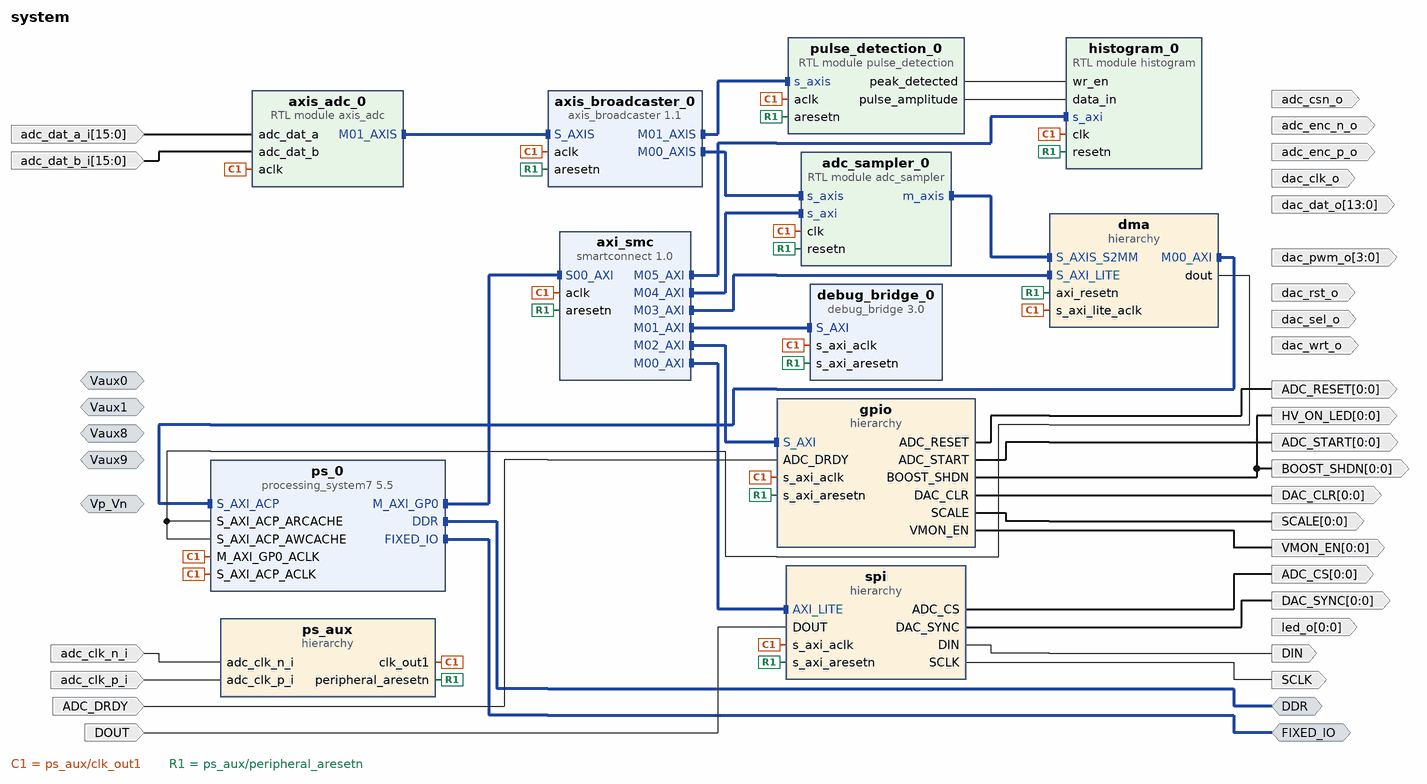
[diagram p0: block diagram of the top level]
# Vivado block design system, xc7z010clg400-1, Vivado 2025.1
create_bd_design system

create_bd_intf_port -mode Slave -vlnv xilinx.com:interface:diff_analog_io_rtl:1.0 Vp_Vn
create_bd_intf_port -mode Slave -vlnv xilinx.com:interface:diff_analog_io_rtl:1.0 Vaux0
create_bd_intf_port -mode Slave -vlnv xilinx.com:interface:diff_analog_io_rtl:1.0 Vaux1
create_bd_intf_port -mode Slave -vlnv xilinx.com:interface:diff_analog_io_rtl:1.0 Vaux9
create_bd_intf_port -mode Slave -vlnv xilinx.com:interface:diff_analog_io_rtl:1.0 Vaux8
create_bd_intf_port -mode Master -vlnv xilinx.com:interface:ddrx_rtl:1.0 DDR
create_bd_intf_port -mode Master -vlnv xilinx.com:display_processing_system7:fixedio_rtl:1.0 FIXED_IO
create_bd_port -dir I -from 15 -to 0 adc_dat_a_i
create_bd_port -dir I -from 15 -to 0 adc_dat_b_i
create_bd_port -dir I adc_clk_p_i
create_bd_port -dir I adc_clk_n_i
create_bd_port -dir O adc_enc_p_o
create_bd_port -dir O adc_enc_n_o
create_bd_port -dir O adc_csn_o
create_bd_port -dir O -from 13 -to 0 dac_dat_o
create_bd_port -dir O dac_clk_o
create_bd_port -dir O dac_rst_o
create_bd_port -dir O dac_sel_o
create_bd_port -dir O dac_wrt_o
create_bd_port -dir O -from 3 -to 0 dac_pwm_o
create_bd_port -dir O -from 0 -to 0 led_o
create_bd_port -dir O -type data DIN
create_bd_port -dir O -type clk SCLK
create_bd_port -dir I -type data DOUT
create_bd_port -dir O -from 0 -to 0 -type rst DAC_CLR
create_bd_port -dir O -from 0 -to 0 -type data BOOST_SHDN
create_bd_port -dir O -from 0 -to 0 -type ce DAC_SYNC
create_bd_port -dir O -from 0 -to 0 -type data SCALE
create_bd_port -dir O -from 0 -to 0 HV_ON_LED
create_bd_port -dir O -from 0 -to 0 ADC_CS
create_bd_port -dir I -type data ADC_DRDY
create_bd_port -dir O -from 0 -to 0 -type rst ADC_RESET
create_bd_port -dir O -from 0 -to 0 -type data ADC_START
create_bd_port -dir O -from 0 -to 0 -type data VMON_EN

create_bd_cell -type ip -vlnv xilinx.com:ip:processing_system7:5.5 ps_0
set_property -dict [list \
  CONFIG.PCW_APU_PERIPHERAL_FREQMHZ 666.666666 \
  CONFIG.PCW_ENET0_PERIPHERAL_ENABLE 0 \
  CONFIG.PCW_FPGA0_PERIPHERAL_FREQMHZ 50 \
  CONFIG.PCW_FPGA1_PERIPHERAL_FREQMHZ 50 \
  CONFIG.PCW_GPIO_MIO_GPIO_ENABLE 0 \
  CONFIG.PCW_IMPORT_BOARD_PRESET cfg/red_pitaya.xml \
  CONFIG.PCW_PRESET_BANK1_VOLTAGE {LVCMOS 3.3V} \
  CONFIG.PCW_QSPI_PERIPHERAL_ENABLE 0 \
  CONFIG.PCW_SD0_PERIPHERAL_ENABLE 0 \
  CONFIG.PCW_UART1_PERIPHERAL_ENABLE 0 \
  CONFIG.PCW_UIPARAM_DDR_FREQ_MHZ 533.333333 \
  CONFIG.PCW_UIPARAM_DDR_PARTNO {MT41J128M8 JP-125} \
  CONFIG.PCW_USB0_PERIPHERAL_ENABLE 0 \
  CONFIG.PCW_USE_DEFAULT_ACP_USER_VAL 1 \
  CONFIG.PCW_USE_S_AXI_ACP 1 \
] [get_bd_cells ps_0]
# 269 more settings of ps_0 are not shown: defaults, MIO pin electricals, DDR timing, and values the tool derives
create_bd_cell -type ip -vlnv xilinx.com:ip:debug_bridge:3.0 debug_bridge_0
set_property -dict {CONFIG.C_DEBUG_MODE 2} [get_bd_cells debug_bridge_0]
create_bd_cell -type module -reference axis_adc axis_adc_0
create_bd_cell -type ip -vlnv xilinx.com:ip:smartconnect:1.0 axi_smc
set_property -dict {CONFIG.NUM_MI 6 CONFIG.NUM_SI 1} [get_bd_cells axi_smc]
create_bd_cell -type module -reference adc_sampler adc_sampler_0
create_bd_cell -type module -reference histogram histogram_0
create_bd_cell -type hier gpio
create_bd_cell -type hier spi
create_bd_cell -type hier dma
create_bd_cell -type hier ps_aux
create_bd_cell -type module -reference pulse_detection pulse_detection_0
create_bd_cell -type ip -vlnv xilinx.com:ip:axis_broadcaster:1.1 axis_broadcaster_0
set_property -dict [list \
  CONFIG.HAS_TKEEP 1 \
  CONFIG.HAS_TLAST 1 \
  CONFIG.HAS_TREADY 0 \
  CONFIG.HAS_TSTRB 0 \
  CONFIG.M_TDATA_NUM_BYTES 2 \
  CONFIG.S_TDATA_NUM_BYTES 2 \
] [get_bd_cells axis_broadcaster_0]

# ---- hierarchy /gpio ----
current_bd_instance /gpio
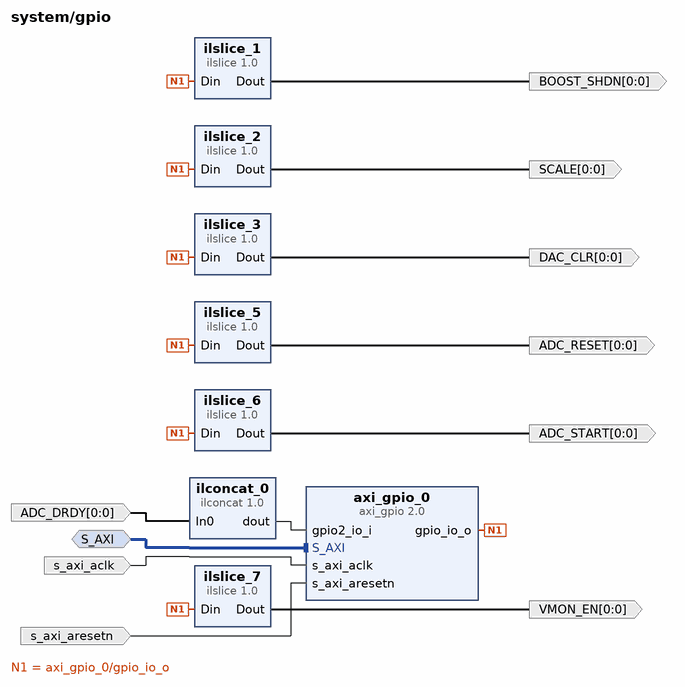
[diagram p1: block diagram inside /gpio]
create_bd_intf_pin -mode Slave -vlnv xilinx.com:interface:aximm_rtl:1.0 S_AXI
create_bd_pin -dir O -from 0 -to 0 DAC_CLR
create_bd_pin -dir O -from 0 -to 0 ADC_RESET
create_bd_pin -dir O -from 0 -to 0 ADC_START
create_bd_pin -dir I -type clk s_axi_aclk
create_bd_pin -dir I -type rst s_axi_aresetn
create_bd_pin -dir O -from 0 -to 0 BOOST_SHDN
create_bd_pin -dir O -from 0 -to 0 SCALE
create_bd_pin -dir O -from 0 -to 0 VMON_EN
create_bd_pin -dir I -from 0 -to 0 ADC_DRDY

create_bd_cell -type inline_hdl -vlnv xilinx.com:inline_hdl:ilslice:1.0 ilslice_3
set_property -dict {CONFIG.DIN_FROM 1 CONFIG.DIN_TO 1 CONFIG.DIN_WIDTH 6} [get_bd_cells ilslice_3]
create_bd_cell -type inline_hdl -vlnv xilinx.com:inline_hdl:ilslice:1.0 ilslice_5
set_property -dict {CONFIG.DIN_FROM 3 CONFIG.DIN_TO 3 CONFIG.DIN_WIDTH 6} [get_bd_cells ilslice_5]
create_bd_cell -type inline_hdl -vlnv xilinx.com:inline_hdl:ilslice:1.0 ilslice_6
set_property -dict {CONFIG.DIN_FROM 4 CONFIG.DIN_TO 4 CONFIG.DIN_WIDTH 6} [get_bd_cells ilslice_6]
create_bd_cell -type ip -vlnv xilinx.com:ip:axi_gpio:2.0 axi_gpio_0
set_property -dict [list \
  CONFIG.C_ALL_INPUTS 0 \
  CONFIG.C_ALL_INPUTS_2 1 \
  CONFIG.C_ALL_OUTPUTS 1 \
  CONFIG.C_GPIO2_WIDTH 1 \
  CONFIG.C_GPIO_WIDTH 6 \
  CONFIG.C_IS_DUAL 1 \
] [get_bd_cells axi_gpio_0]
create_bd_cell -type inline_hdl -vlnv xilinx.com:inline_hdl:ilslice:1.0 ilslice_1
set_property -dict {CONFIG.DIN_WIDTH 6} [get_bd_cells ilslice_1]
create_bd_cell -type inline_hdl -vlnv xilinx.com:inline_hdl:ilslice:1.0 ilslice_2
set_property -dict {CONFIG.DIN_FROM 2 CONFIG.DIN_TO 2 CONFIG.DIN_WIDTH 6} [get_bd_cells ilslice_2]
create_bd_cell -type inline_hdl -vlnv xilinx.com:inline_hdl:ilslice:1.0 ilslice_7
set_property -dict {CONFIG.DIN_FROM 5 CONFIG.DIN_TO 5 CONFIG.DIN_WIDTH 6} [get_bd_cells ilslice_7]
create_bd_cell -type inline_hdl -vlnv xilinx.com:inline_hdl:ilconcat:1.0 ilconcat_0
set_property -dict {CONFIG.IN0_WIDTH 1 CONFIG.NUM_PORTS 1} [get_bd_cells ilconcat_0]

# ---- hierarchy /spi ----
current_bd_instance /spi
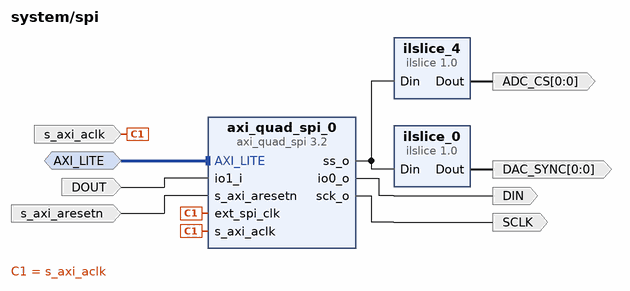
[diagram p2: block diagram inside /spi]
create_bd_intf_pin -mode Slave -vlnv xilinx.com:interface:aximm_rtl:1.0 AXI_LITE
create_bd_pin -dir O -from 0 -to 0 ADC_CS
create_bd_pin -dir O -from 0 -to 0 DAC_SYNC
create_bd_pin -dir I -type clk s_axi_aclk
create_bd_pin -dir I -type rst s_axi_aresetn
create_bd_pin -dir O DIN
create_bd_pin -dir I -type data DOUT
create_bd_pin -dir O SCLK

create_bd_cell -type inline_hdl -vlnv xilinx.com:inline_hdl:ilslice:1.0 ilslice_4
set_property -dict {CONFIG.DIN_FROM 1 CONFIG.DIN_TO 1 CONFIG.DIN_WIDTH 2} [get_bd_cells ilslice_4]
create_bd_cell -type inline_hdl -vlnv xilinx.com:inline_hdl:ilslice:1.0 ilslice_0
set_property -dict {CONFIG.DIN_WIDTH 2} [get_bd_cells ilslice_0]
create_bd_cell -type ip -vlnv xilinx.com:ip:axi_quad_spi:3.2 axi_quad_spi_0
set_property -dict [list \
  CONFIG.C_NUM_SS_BITS 2 \
  CONFIG.C_SPI_MODE 0 \
  CONFIG.C_USE_STARTUP 0 \
  CONFIG.FIFO_INCLUDED 0 \
  CONFIG.Master_mode 1 \
  CONFIG.Multiples16 8 \
] [get_bd_cells axi_quad_spi_0]

# ---- hierarchy /dma ----
current_bd_instance /dma
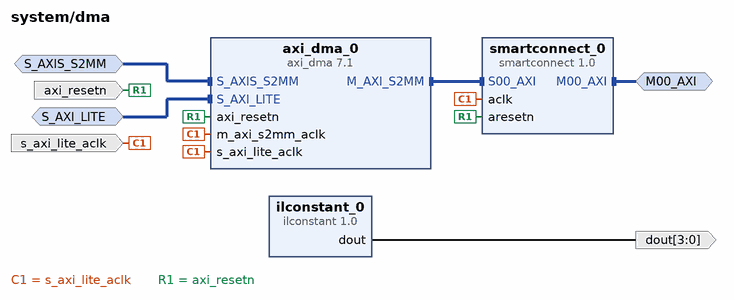
[diagram p3: block diagram inside /dma]
create_bd_intf_pin -mode Master -vlnv xilinx.com:interface:aximm_rtl:1.0 M00_AXI
create_bd_intf_pin -mode Slave -vlnv xilinx.com:interface:aximm_rtl:1.0 S_AXI_LITE
create_bd_intf_pin -mode Slave -vlnv xilinx.com:interface:axis_rtl:1.0 S_AXIS_S2MM
create_bd_pin -dir I -type clk s_axi_lite_aclk
create_bd_pin -dir I -type rst axi_resetn
create_bd_pin -dir O -from 3 -to 0 dout

create_bd_cell -type ip -vlnv xilinx.com:ip:smartconnect:1.0 smartconnect_0
set_property -dict {CONFIG.NUM_SI 1} [get_bd_cells smartconnect_0]
create_bd_cell -type inline_hdl -vlnv xilinx.com:inline_hdl:ilconstant:1.0 ilconstant_0
set_property -dict {CONFIG.CONST_VAL 0xF CONFIG.CONST_WIDTH 4} [get_bd_cells ilconstant_0]
create_bd_cell -type ip -vlnv xilinx.com:ip:axi_dma:7.1 axi_dma_0
set_property -dict [list \
  CONFIG.c_include_mm2s 0 \
  CONFIG.c_include_s2mm_dre 1 \
  CONFIG.c_include_sg 0 \
  CONFIG.c_s_axis_s2mm_tdata_width 16 \
  CONFIG.c_sg_length_width 20 \
] [get_bd_cells axi_dma_0]

# ---- hierarchy /ps_aux ----
current_bd_instance /ps_aux
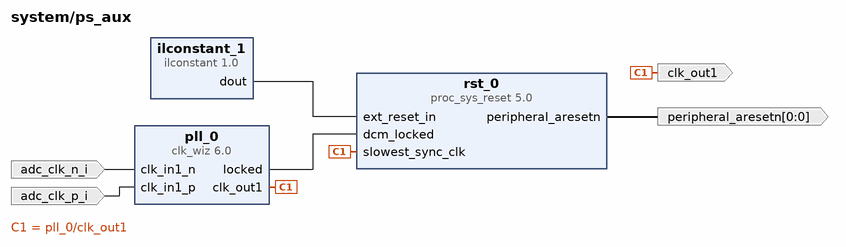
[diagram p4: block diagram inside /ps_aux]
create_bd_pin -dir O -type clk clk_out1
create_bd_pin -dir O -from 0 -to 0 -type rst peripheral_aresetn
create_bd_pin -dir I adc_clk_p_i
create_bd_pin -dir I adc_clk_n_i

create_bd_cell -type ip -vlnv xilinx.com:ip:proc_sys_reset:5.0 rst_0
create_bd_cell -type ip -vlnv xilinx.com:ip:clk_wiz:6.0 pll_0
set_property -dict [list \
  CONFIG.CLKOUT1_REQUESTED_OUT_FREQ 125.0 \
  CONFIG.CLKOUT1_USED true \
  CONFIG.CLKOUT2_REQUESTED_OUT_FREQ 250.0 \
  CONFIG.CLKOUT2_REQUESTED_PHASE 157.5 \
  CONFIG.CLKOUT2_USED true \
  CONFIG.CLKOUT3_REQUESTED_OUT_FREQ 250.0 \
  CONFIG.CLKOUT3_REQUESTED_PHASE 202.5 \
  CONFIG.CLKOUT3_USED true \
  CONFIG.PRIMITIVE PLL \
  CONFIG.PRIM_IN_FREQ 125.0 \
  CONFIG.PRIM_SOURCE Differential_clock_capable_pin \
  CONFIG.USE_RESET false \
] [get_bd_cells pll_0]
create_bd_cell -type inline_hdl -vlnv xilinx.com:inline_hdl:ilconstant:1.0 ilconstant_1
set_property -dict {CONFIG.CONST_VAL 1 CONFIG.CONST_WIDTH 1} [get_bd_cells ilconstant_1]

# ---- connections ----

current_bd_instance /gpio
connect_bd_intf_net -intf_net axi_smc_M02_AXI [get_bd_intf_pins S_AXI] [get_bd_intf_pins axi_gpio_0/S_AXI]
connect_bd_net [get_bd_pins ADC_DRDY] [get_bd_pins ilconcat_0/In0]
connect_bd_net [get_bd_pins axi_gpio_0/gpio_io_o] \
  [get_bd_pins ilslice_1/Din] [get_bd_pins ilslice_2/Din] [get_bd_pins ilslice_3/Din] [get_bd_pins ilslice_5/Din] \
  [get_bd_pins ilslice_6/Din] [get_bd_pins ilslice_7/Din]
connect_bd_net [get_bd_pins ilconcat_0/dout] [get_bd_pins axi_gpio_0/gpio2_io_i]
connect_bd_net [get_bd_pins ilslice_1/Dout] [get_bd_pins BOOST_SHDN]
connect_bd_net [get_bd_pins ilslice_2/Dout] [get_bd_pins SCALE]
connect_bd_net [get_bd_pins ilslice_3/Dout] [get_bd_pins DAC_CLR]
connect_bd_net [get_bd_pins ilslice_5/Dout] [get_bd_pins ADC_RESET]
connect_bd_net [get_bd_pins ilslice_6/Dout] [get_bd_pins ADC_START]
connect_bd_net [get_bd_pins ilslice_7/Dout] [get_bd_pins VMON_EN]
connect_bd_net -net pll_0_clk_out1 [get_bd_pins s_axi_aclk] [get_bd_pins axi_gpio_0/s_axi_aclk]
connect_bd_net -net rst_0_peripheral_aresetn [get_bd_pins s_axi_aresetn] [get_bd_pins axi_gpio_0/s_axi_aresetn]

current_bd_instance /spi
connect_bd_intf_net -intf_net axi_smc_M00_AXI [get_bd_intf_pins AXI_LITE] [get_bd_intf_pins axi_quad_spi_0/AXI_LITE]
connect_bd_net [get_bd_pins DOUT] [get_bd_pins axi_quad_spi_0/io1_i]
connect_bd_net [get_bd_pins axi_quad_spi_0/io0_o] [get_bd_pins DIN]
connect_bd_net [get_bd_pins axi_quad_spi_0/sck_o] [get_bd_pins SCLK]
connect_bd_net [get_bd_pins axi_quad_spi_0/ss_o] [get_bd_pins ilslice_0/Din] [get_bd_pins ilslice_4/Din]
connect_bd_net [get_bd_pins ilslice_0/Dout] [get_bd_pins DAC_SYNC]
connect_bd_net [get_bd_pins ilslice_4/Dout] [get_bd_pins ADC_CS]
connect_bd_net -net pll_0_clk_out1 [get_bd_pins s_axi_aclk] [get_bd_pins axi_quad_spi_0/s_axi_aclk] [get_bd_pins axi_quad_spi_0/ext_spi_clk]
connect_bd_net -net rst_0_peripheral_aresetn [get_bd_pins s_axi_aresetn] [get_bd_pins axi_quad_spi_0/s_axi_aresetn]

current_bd_instance /dma
connect_bd_intf_net -intf_net adc_sampler_0_m_axis [get_bd_intf_pins S_AXIS_S2MM] [get_bd_intf_pins axi_dma_0/S_AXIS_S2MM]
connect_bd_intf_net [get_bd_intf_pins axi_dma_0/M_AXI_S2MM] [get_bd_intf_pins smartconnect_0/S00_AXI]
connect_bd_intf_net -intf_net axi_smc_M03_AXI [get_bd_intf_pins S_AXI_LITE] [get_bd_intf_pins axi_dma_0/S_AXI_LITE]
connect_bd_intf_net [get_bd_intf_pins M00_AXI] [get_bd_intf_pins smartconnect_0/M00_AXI]
connect_bd_net [get_bd_pins ilconstant_0/dout] [get_bd_pins dout]
connect_bd_net -net pll_0_clk_out1 [get_bd_pins s_axi_lite_aclk] \
  [get_bd_pins axi_dma_0/s_axi_lite_aclk] [get_bd_pins axi_dma_0/m_axi_s2mm_aclk] [get_bd_pins smartconnect_0/aclk]
connect_bd_net -net rst_0_peripheral_aresetn [get_bd_pins axi_resetn] [get_bd_pins axi_dma_0/axi_resetn] [get_bd_pins smartconnect_0/aresetn]

current_bd_instance /ps_aux
connect_bd_net [get_bd_pins adc_clk_n_i] [get_bd_pins pll_0/clk_in1_n]
connect_bd_net [get_bd_pins adc_clk_p_i] [get_bd_pins pll_0/clk_in1_p]
connect_bd_net [get_bd_pins ilconstant_1/dout] [get_bd_pins rst_0/ext_reset_in]
connect_bd_net [get_bd_pins pll_0/clk_out1] [get_bd_pins clk_out1] [get_bd_pins rst_0/slowest_sync_clk]
connect_bd_net [get_bd_pins pll_0/locked] [get_bd_pins rst_0/dcm_locked]
connect_bd_net [get_bd_pins rst_0/peripheral_aresetn] [get_bd_pins peripheral_aresetn]

current_bd_instance /
connect_bd_intf_net [get_bd_intf_pins adc_sampler_0/m_axis] [get_bd_intf_pins dma/S_AXIS_S2MM]
connect_bd_intf_net [get_bd_intf_pins axi_smc/M00_AXI] [get_bd_intf_pins spi/AXI_LITE]
connect_bd_intf_net [get_bd_intf_pins axi_smc/M01_AXI] [get_bd_intf_pins debug_bridge_0/S_AXI]
connect_bd_intf_net [get_bd_intf_pins axi_smc/M02_AXI] [get_bd_intf_pins gpio/S_AXI]
connect_bd_intf_net [get_bd_intf_pins axi_smc/M03_AXI] [get_bd_intf_pins dma/S_AXI_LITE]
connect_bd_intf_net [get_bd_intf_pins axi_smc/M04_AXI] [get_bd_intf_pins adc_sampler_0/s_axi]
connect_bd_intf_net [get_bd_intf_pins axi_smc/M05_AXI] [get_bd_intf_pins histogram_0/s_axi]
connect_bd_intf_net [get_bd_intf_pins axis_broadcaster_0/S_AXIS] [get_bd_intf_pins axis_adc_0/M01_AXIS]
connect_bd_intf_net [get_bd_intf_pins axis_broadcaster_0/M00_AXIS] [get_bd_intf_pins adc_sampler_0/s_axis]
connect_bd_intf_net [get_bd_intf_pins axis_broadcaster_0/M01_AXIS] [get_bd_intf_pins pulse_detection_0/s_axis]
connect_bd_intf_net [get_bd_intf_ports DDR] [get_bd_intf_pins ps_0/DDR]
connect_bd_intf_net [get_bd_intf_ports FIXED_IO] [get_bd_intf_pins ps_0/FIXED_IO]
connect_bd_intf_net [get_bd_intf_pins ps_0/M_AXI_GP0] [get_bd_intf_pins axi_smc/S00_AXI]
connect_bd_intf_net -intf_net smartconnect_0_M00_AXI [get_bd_intf_pins dma/M00_AXI] [get_bd_intf_pins ps_0/S_AXI_ACP]
connect_bd_net [get_bd_ports ADC_DRDY] [get_bd_pins gpio/ADC_DRDY]
connect_bd_net [get_bd_ports DOUT] [get_bd_pins spi/DOUT]
connect_bd_net [get_bd_ports adc_clk_n_i] [get_bd_pins ps_aux/adc_clk_n_i]
connect_bd_net [get_bd_ports adc_clk_p_i] [get_bd_pins ps_aux/adc_clk_p_i]
connect_bd_net [get_bd_ports adc_dat_a_i] [get_bd_pins axis_adc_0/adc_dat_a]
connect_bd_net [get_bd_ports adc_dat_b_i] [get_bd_pins axis_adc_0/adc_dat_b]
connect_bd_net -net axi_quad_spi_0_io0_o [get_bd_pins spi/DIN] [get_bd_ports DIN]
connect_bd_net -net axi_quad_spi_0_sck_o [get_bd_pins spi/SCLK] [get_bd_ports SCLK]
connect_bd_net -net ilconstant_0_dout [get_bd_pins dma/dout] [get_bd_pins ps_0/S_AXI_ACP_AWCACHE] [get_bd_pins ps_0/S_AXI_ACP_ARCACHE]
connect_bd_net -net ilslice_0_Dout [get_bd_pins spi/DAC_SYNC] [get_bd_ports DAC_SYNC]
connect_bd_net -net ilslice_1_Dout [get_bd_pins gpio/BOOST_SHDN] [get_bd_ports HV_ON_LED] [get_bd_ports BOOST_SHDN]
connect_bd_net -net ilslice_2_Dout [get_bd_pins gpio/SCALE] [get_bd_ports SCALE]
connect_bd_net -net ilslice_3_Dout [get_bd_pins gpio/DAC_CLR] [get_bd_ports DAC_CLR]
connect_bd_net -net ilslice_4_Dout [get_bd_pins spi/ADC_CS] [get_bd_ports ADC_CS]
connect_bd_net -net ilslice_5_Dout [get_bd_pins gpio/ADC_RESET] [get_bd_ports ADC_RESET]
connect_bd_net -net ilslice_6_Dout [get_bd_pins gpio/ADC_START] [get_bd_ports ADC_START]
connect_bd_net -net ilslice_7_Dout [get_bd_pins gpio/VMON_EN] [get_bd_ports VMON_EN]
connect_bd_net -net pll_0_clk_out1 [get_bd_pins ps_aux/clk_out1] \
  [get_bd_pins ps_0/M_AXI_GP0_ACLK] [get_bd_pins debug_bridge_0/s_axi_aclk] [get_bd_pins ps_0/S_AXI_ACP_ACLK] \
  [get_bd_pins axis_adc_0/aclk] [get_bd_pins axi_smc/aclk] [get_bd_pins histogram_0/clk] [get_bd_pins gpio/s_axi_aclk] \
  [get_bd_pins spi/s_axi_aclk] [get_bd_pins dma/s_axi_lite_aclk] [get_bd_pins adc_sampler_0/clk] \
  [get_bd_pins pulse_detection_0/aclk] [get_bd_pins axis_broadcaster_0/aclk]
connect_bd_net [get_bd_pins pulse_detection_0/peak_detected] [get_bd_pins histogram_0/wr_en]
connect_bd_net [get_bd_pins pulse_detection_0/pulse_amplitude] [get_bd_pins histogram_0/data_in]
connect_bd_net -net rst_0_peripheral_aresetn [get_bd_pins ps_aux/peripheral_aresetn] \
  [get_bd_pins debug_bridge_0/s_axi_aresetn] [get_bd_pins axi_smc/aresetn] [get_bd_pins histogram_0/resetn] \
  [get_bd_pins gpio/s_axi_aresetn] [get_bd_pins spi/s_axi_aresetn] [get_bd_pins dma/axi_resetn] \
  [get_bd_pins adc_sampler_0/resetn] [get_bd_pins pulse_detection_0/aresetn] [get_bd_pins axis_broadcaster_0/aresetn]
set_property HDL_ATTRIBUTE.BMM_INFO_PROCESSOR {arm > system axi_bram_ctrl_0} [get_bd_cells ps_0]
set_property HDL_ATTRIBUTE.KEEP_HIERARCHY yes [get_bd_cells ps_0]

# ---- address map ----
assign_bd_address -offset 0x00000000 -range 512M -target_address_space [get_bd_addr_spaces dma/axi_dma_0/Data_S2MM] [get_bd_addr_segs ps_0/S_AXI_ACP/ACP_DDR_LOWOCM]
exclude_bd_addr_seg -offset 0x40000000 -range 1G -target_address_space [get_bd_addr_spaces dma/axi_dma_0/Data_S2MM] [get_bd_addr_segs ps_0/S_AXI_ACP/ACP_M_AXI_GP0]
assign_bd_address -offset 0x40400000 -range 64K -target_address_space [get_bd_addr_spaces ps_0/Data] [get_bd_addr_segs dma/axi_dma_0/S_AXI_LITE/Reg]
assign_bd_address -offset 0x41200000 -range 64K -target_address_space [get_bd_addr_spaces ps_0/Data] [get_bd_addr_segs gpio/axi_gpio_0/S_AXI/Reg]
assign_bd_address -offset 0x41E00000 -range 64K -target_address_space [get_bd_addr_spaces ps_0/Data] [get_bd_addr_segs spi/axi_quad_spi_0/AXI_LITE/Reg]
assign_bd_address -offset 0x43C00000 -range 64K -target_address_space [get_bd_addr_spaces ps_0/Data] [get_bd_addr_segs debug_bridge_0/S_AXI/Reg0]
assign_bd_address -offset 0x50000000 -range 256M -target_address_space [get_bd_addr_spaces ps_0/Data] [get_bd_addr_segs histogram_0/s_axi/reg0]
assign_bd_address -offset 0x60000000 -range 512M -target_address_space [get_bd_addr_spaces ps_0/Data] [get_bd_addr_segs adc_sampler_0/s_axi/reg0]

set_property USER_COMMENTS.comment_0 {d0: BOOST_SDN/HV_ON_LED
d1: DAC_CLR
d2: SCALE
d3: ADC_RESET
d4: ADC_START
d5: VMON_EN} [current_bd_design]

validate_bd_design
save_bd_design
